# Altium schematic sheet USB2.0.SchDoc
size A3; Organization: Altium Limited; Address1: L3, 12a Rodborough Rd; Address2: Frenchs Forest; Address3: NSW; Address4: Australia 2086
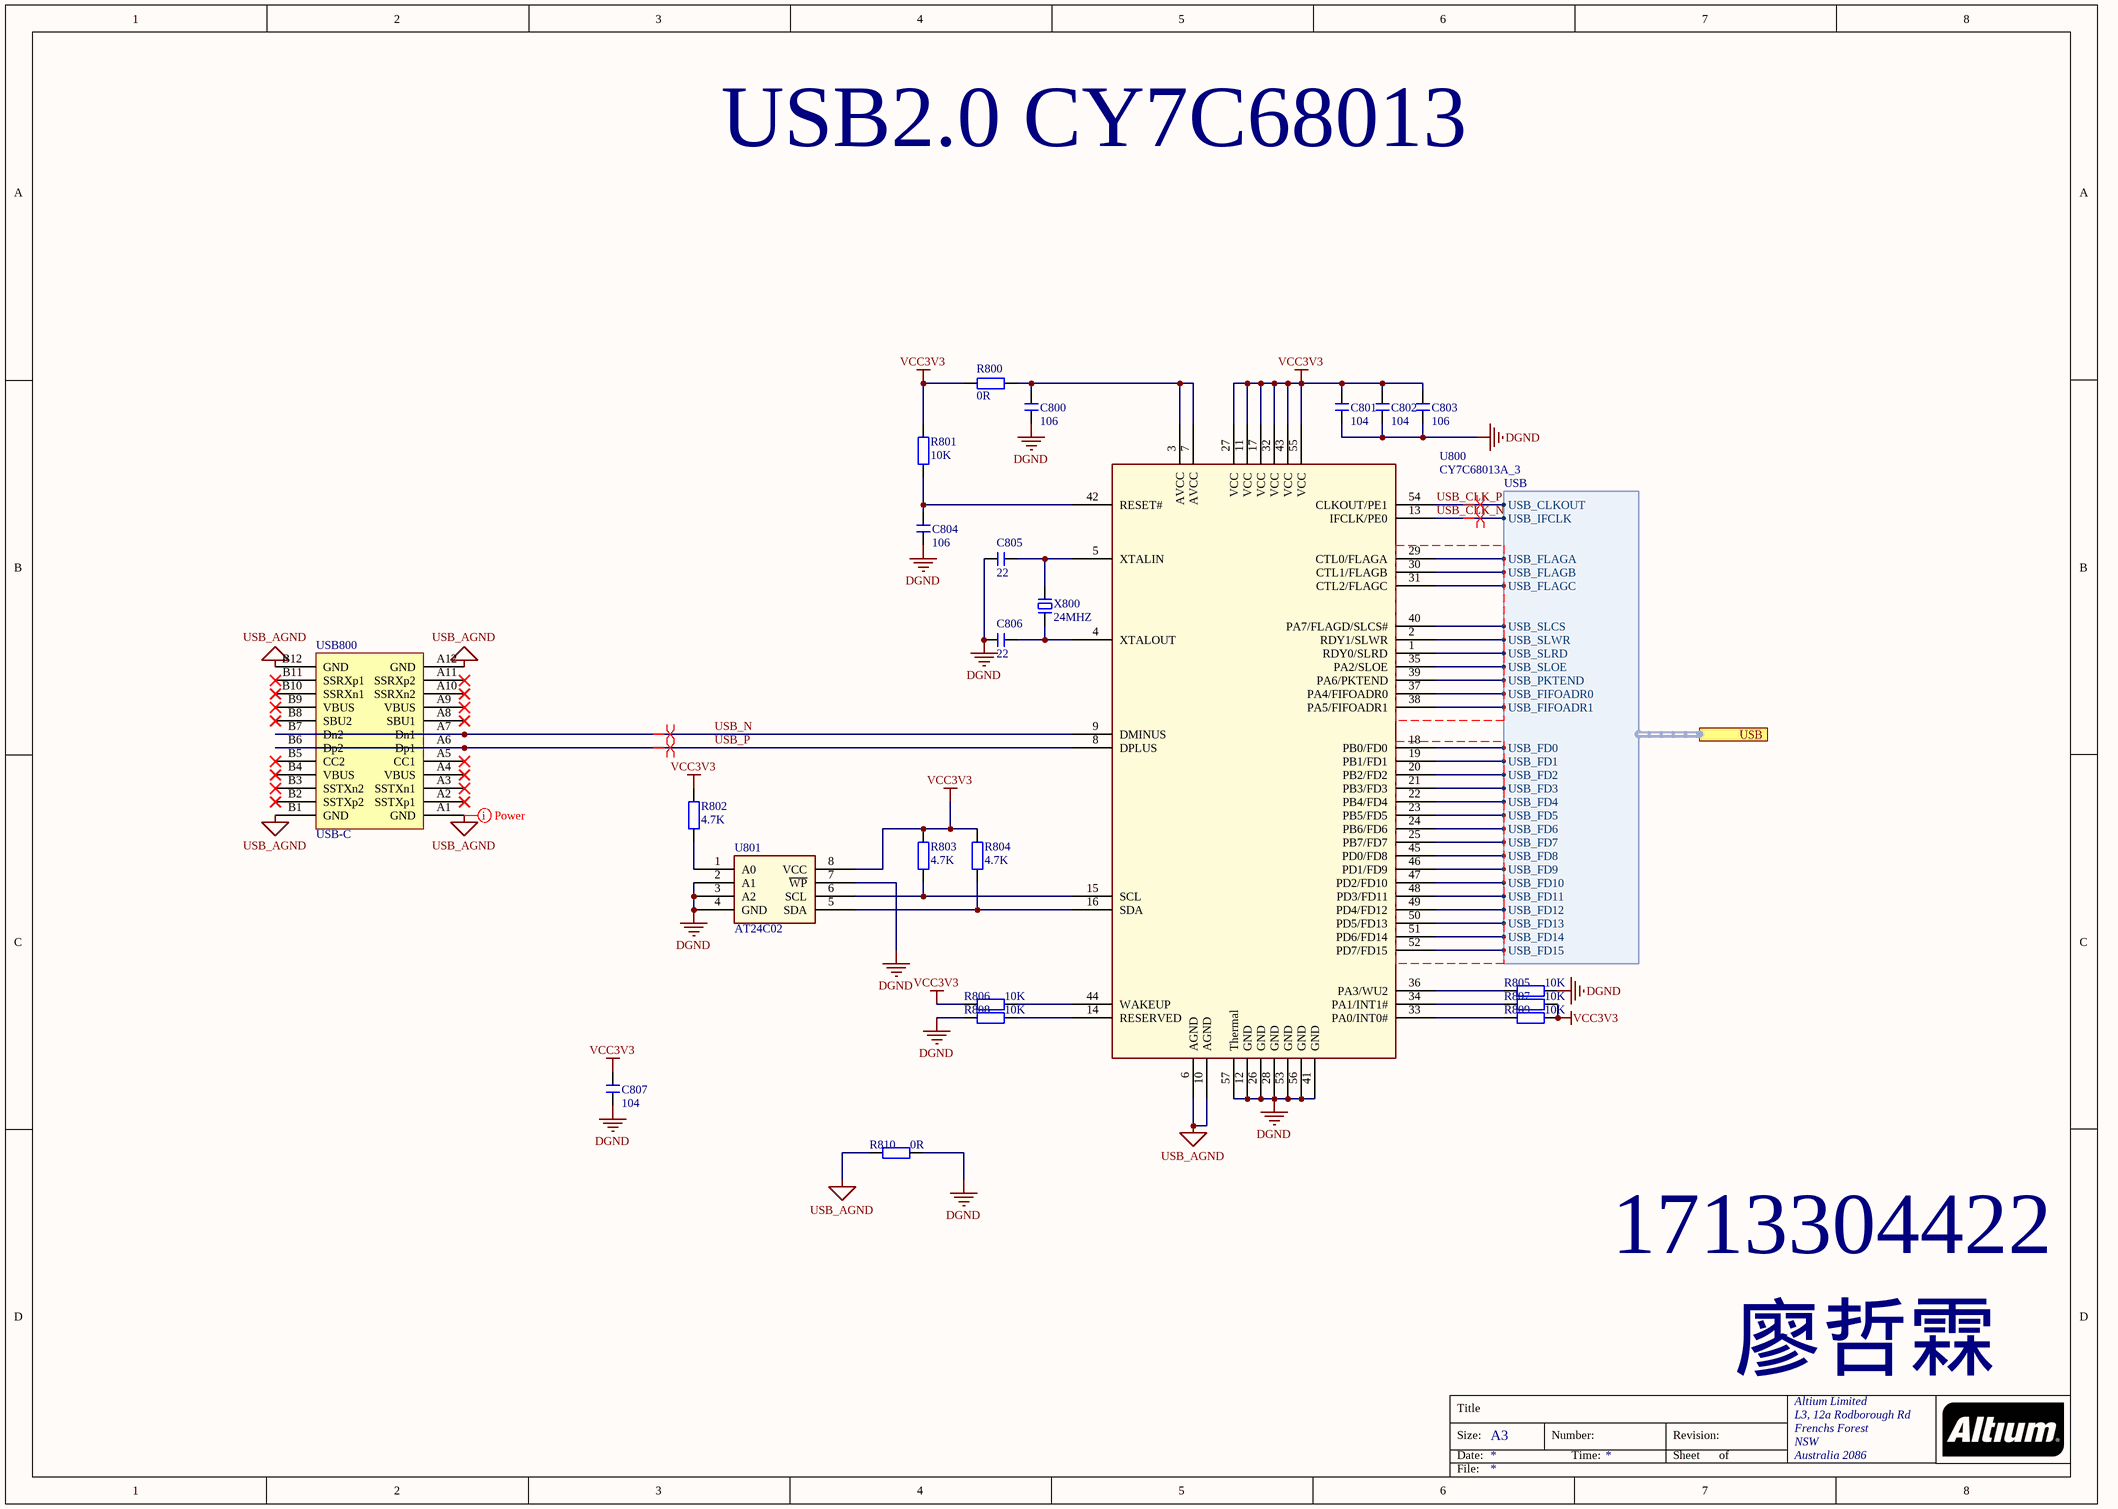
[diagram p0: USB2.0.SchDoc]

## Parts
C800  106  [C 0402_M]
C801  104  [C 0402_M]
C802  104  [C 0402_M]
C803  106  [C 0402_M]
C804  106  [C 0402_M]
C805  22  [C 0402_M]
C806  22  [C 0402_M]
C807  104  [C 0402_M]
R800  0R  [R 0402_M]
R801  10K  [R 0402_M]
R802  4.7K  [R 0402_M]
R803  4.7K  [R 0402_M]
R804  4.7K  [R 0402_M]
R805  10K  [R 0402_M]
R806  10K  [R 0402_M]
R807  10K  [R 0402_M]
R808  10K  [R 0402_M]
R809  10K  [R 0402_M]
R810  0R  [R 0402_M]
U800  CY7C68013A_3  [QFN50P800X800X100-57N]
U801  AT24C02  [SOP8_M]
USB800  USB-C  [USB-C/S_A]
X800  24MHZ  [OSC 5032-2P]

## Ports
USB (harness USB)

## Harnesses
USB: USB_CLKOUT, USB_IFCLK, USB_FLAGA, USB_FLAGB, USB_FLAGC, USB_SLCS, USB_SLWR, USB_SLRD, USB_SLOE, USB_PKTEND, USB_FIFOADR1, USB_FD0, USB_FD1, USB_FD2, USB_FD3, USB_FD4, USB_FD5, USB_FD6, USB_FD7, USB_FD8, USB_FD9, USB_FD10, USB_FD11, USB_FD12, USB_FD13, USB_FD14, USB_FD15, USB_FIFOADR0

## Nets
DGND: C800.1 C801.1 C802.1 C803.1 C804.1 C805.2 C806.2 C807.2 R805.2 R808.1 R810.2 U800.12(GND) U800.26(GND) U800.28(GND) U800.41(GND) U800.53(GND) U800.56(GND) U800.57(Thermal) U801.2(A1) U801.3(A2) U801.4(GND) U801.7(~{WP})
USB_AGND: R810.1 U800.6(AGND) U800.10(AGND) USB800.A1(GND) USB800.A12(GND) USB800.B1(GND) USB800.B12(GND)
VCC3V3: C801.2 C802.2 C803.2 C807.1 R800.2 R801.1 R802.1 R803.1 R804.1 R806.1 R807.2 R809.2 U800.11(VCC) U800.17(VCC) U800.27(VCC) U800.32(VCC) U800.43(VCC) U800.55(VCC) U801.8(VCC)
USB_CLK_N: U800.13(IFCLK/PE0) ; port USB.USB_IFCLK
USB_CLK_P: U800.54(CLKOUT/PE1) ; port USB.USB_CLKOUT
USB_N: U800.9(DMINUS) USB800.A7(Dn1) USB800.B7(Dn2)
USB_P: U800.8(DPLUS) USB800.A6(Dp1) USB800.B6(Dp2)
NetC800_2: C800.2 R800.1 U800.3(AVCC) U800.7(AVCC)
NetC804_2: C804.2 R801.2 U800.42(RESET#)
NetC805_1: C805.1 U800.5(XTALIN) X800.2
NetC806_1: C806.1 U800.4(XTALOUT) X800.1
NetR802_2: R802.2 U801.1(A0)
NetR803_2: R803.2 U800.15(SCL) U801.6(SCL)
NetR804_2: R804.2 U800.16(SDA) U801.5(SDA)
NetR805_1: R805.1 U800.36(PA3/WU2)
NetR806_2: R806.2 U800.44(WAKEUP)
NetR807_1: R807.1 U800.34(PA1/INT1#)
NetR808_2: R808.2 U800.14(RESERVED)
NetR809_1: R809.1 U800.33(PA0/INT0#)
NetU800_1: U800.1(RDY0/SLRD) ; port USB.USB_SLRD
NetU800_2: U800.2(RDY1/SLWR) ; port USB.USB_SLWR
NetU800_18: U800.18(PB0/FD0) ; port USB.USB_FD0
NetU800_19: U800.19(PB1/FD1) ; port USB.USB_FD1
NetU800_20: U800.20(PB2/FD2) ; port USB.USB_FD2
NetU800_21: U800.21(PB3/FD3) ; port USB.USB_FD3
NetU800_22: U800.22(PB4/FD4) ; port USB.USB_FD4
NetU800_23: U800.23(PB5/FD5) ; port USB.USB_FD5
NetU800_24: U800.24(PB6/FD6) ; port USB.USB_FD6
NetU800_25: U800.25(PB7/FD7) ; port USB.USB_FD7
NetU800_29: U800.29(CTL0/FLAGA) ; port USB.USB_FLAGA
NetU800_30: U800.30(CTL1/FLAGB) ; port USB.USB_FLAGB
NetU800_31: U800.31(CTL2/FLAGC) ; port USB.USB_FLAGC
NetU800_35: U800.35(PA2/SLOE) ; port USB.USB_SLOE
NetU800_37: U800.37(PA4/FIFOADR0) ; port USB.USB_FIFOADR0
NetU800_38: U800.38(PA5/FIFOADR1) ; port USB.USB_FIFOADR1
NetU800_39: U800.39(PA6/PKTEND) ; port USB.USB_PKTEND
NetU800_40: U800.40(PA7/FLAGD/SLCS#) ; port USB.USB_SLCS
NetU800_45: U800.45(PD0/FD8) ; port USB.USB_FD8
NetU800_46: U800.46(PD1/FD9) ; port USB.USB_FD9
NetU800_47: U800.47(PD2/FD10) ; port USB.USB_FD10
NetU800_48: U800.48(PD3/FD11) ; port USB.USB_FD11
NetU800_49: U800.49(PD4/FD12) ; port USB.USB_FD12
NetU800_50: U800.50(PD5/FD13) ; port USB.USB_FD13
NetU800_51: U800.51(PD6/FD14) ; port USB.USB_FD14
NetU800_52: U800.52(PD7/FD15) ; port USB.USB_FD15

Not connected (* = marked no-connect by the designer): USB800 A2(SSTXp1)* A3(SSTXn1)* A4(VBUS)* A5(CC1)* A8(SBU1)* A9(VBUS)* A10(SSRXn2)* A11(SSRXp2)* B2(SSTXp2)* B3(SSTXn2)* B4(VBUS)* B5(CC2)* B8(SBU2)* B9(VBUS)* B10(SSRXn1)* B11(SSRXp1)*

## Layout directives
net class Power: USB_AGND
differential pair; differential pair class USB; rule Matched Net Lengths [Tolerance = 5mil]: USB_CLK_N, USB_CLK_P, USB_N, USB_P
net class USB_FD; rule Matched Net Lengths [Tolerance = 100mil]: (no net found under the mark)
net class USB_FIFO; rule Matched Net Lengths [Tolerance = 100mil]: (no net found under the mark)

## Notes on the sheet
- USB2.0 CY7C68013
- 1713304422
- 廖哲霖
- Title
- Size:
- Date:
- A3
- Number:
- Time:
- Revision:
- Sheet
- of
- File:

## Library data of the parts
C800-C807 = C: 无极性贴片电容; 版权归属: 源创客; BOM名称: 无极性贴片电容; 学习资源: www.ooocke.com
R800-R810 = R: 贴片电阻; 版权归属: 源创客; BOM名称: 贴片电阻; 学习资源: www.ooocke.com
USB800 = USB-C/S: USB-C型母接口; 版权归属: 源创客; BOM名称: USB-C型母接口; 学习资源: www.ooocke.com
X800 = XTAL-2P: 2脚无源脚晶振; 版权归属: 源创客; BOM名称: 2脚无源脚晶振; 学习资源: www.ooocke.com